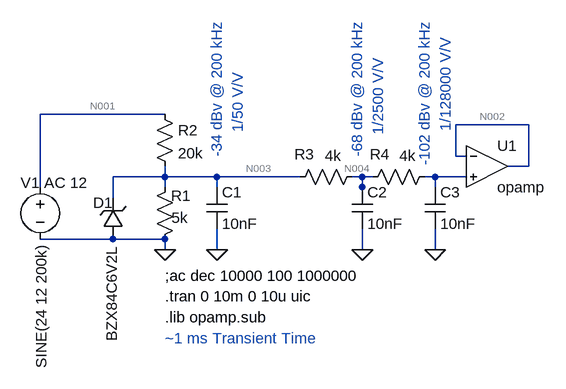
[diagram p0: schematic Draft1.asc]
Draft1.asc, the LTspice schematic file:
Version 4
SHEET 1 1332 680
WIRE 288 48 96 48
WIRE 848 64 736 64
WIRE 736 112 736 64
WIRE 752 112 736 112
WIRE 848 128 848 64
WIRE 848 128 816 128
WIRE 288 144 288 128
WIRE 288 144 208 144
WIRE 368 144 288 144
WIRE 496 144 368 144
WIRE 592 144 576 144
WIRE 608 144 592 144
WIRE 704 144 688 144
WIRE 752 144 704 144
WIRE 96 160 96 48
WIRE 288 160 288 144
WIRE 368 160 368 144
WIRE 592 160 592 144
WIRE 704 160 704 144
WIRE 208 176 208 144
WIRE 592 176 592 160
WIRE 208 240 96 240
WIRE 288 240 208 240
WIRE 288 256 288 240
WIRE 368 256 368 224
WIRE 592 256 592 224
WIRE 704 256 704 224
FLAG 288 256 0
FLAG 592 256 0
FLAG 704 256 0
FLAG 368 256 0
SYMBOL res 304 144 M0
WINDOW 0 -24 29 Left 2
WINDOW 3 -20 63 Left 2
SYMATTR InstName R1
SYMATTR Value 5k
SYMBOL zener 224 240 R180
WINDOW 0 16 56 Left 2
WINDOW 3 18 -157 VRight 2
SYMATTR InstName D1
SYMATTR Value BZX84C6V2L
SYMATTR Description Diode
SYMATTR Type diode
SYMBOL res 272 32 R0
SYMATTR InstName R2
SYMATTR Value 20k
SYMBOL voltage 96 144 R0
WINDOW 3 2 103 VRight 2
WINDOW 123 6 9 Left 2
WINDOW 39 0 0 Left 0
WINDOW 0 -30 9 Left 2
SYMATTR Value SINE(24 12 200k)
SYMATTR Value2 AC 12
SYMATTR InstName V1
SYMBOL cap 352 160 R0
SYMATTR InstName C1
SYMATTR Value 10nF
SYMBOL Opamps\\opamp 784 64 R0
SYMATTR InstName U1
SYMBOL res 592 128 R90
WINDOW 0 -3 89 VBottom 2
WINDOW 3 -32 45 VTop 2
SYMATTR InstName R3
SYMATTR Value 4k
SYMBOL cap 576 160 R0
SYMATTR InstName C2
SYMATTR Value 10nF
SYMBOL res 704 128 R90
WINDOW 0 -3 85 VBottom 2
WINDOW 3 -32 42 VTop 2
SYMATTR InstName R4
SYMATTR Value 4k
SYMBOL cap 688 160 R0
SYMATTR InstName C3
SYMATTR Value 10nF
TEXT 288 328 Left 2 !.tran 0 10m 0 10u uic
TEXT 288 360 Left 2 !.lib opamp.sub
TEXT 688 -96 VRight 2 ;-102 dBv @ 200 kHz
TEXT 584 -96 VRight 2 ;-68 dBv @ 200 kHz
TEXT 368 -96 VRight 2 ;-34 dBv @ 200 kHz
TEXT 288 296 Left 2 !;ac dec 10000 100 1000000
TEXT 400 -16 VRight 2 ;1/50 V/V
TEXT 616 -40 VRight 2 ;1/2500 V/V
TEXT 720 -72 VRight 2 ;1/128000 V/V
TEXT 288 392 Left 2 ;~1 ms Transient Time

The netlist it stands for:
* Draft1.asc
R1 N003 0 5k
D1 0 N003 BZX84C6V2L
R2 N001 N003 20k
V1 N001 0 SINE(24 12 200k) AC 12
C1 N003 0 10nF
XU1 N002 N005 N002 opamp Aol=100K GBW=10Meg  ; pins invin noninvin out
R3 N004 N003 4k
C2 N004 0 10nF
R4 N005 N004 4k
C3 N005 0 10nF
.model D D
.lib standard.dio
.tran 0 10m 0 10u uic
.lib opamp.sub
* -102 dBv @ 200 kHz
* -68 dBv @ 200 kHz
* -34 dBv @ 200 kHz
;ac dec 10000 100 1000000
* 1/50 V/V
* 1/2500 V/V
* 1/128000 V/V
* ~1 ms Transient Time
.backanno
.end

* Results of the author's LTspice run, read from the files saved beside the schematic
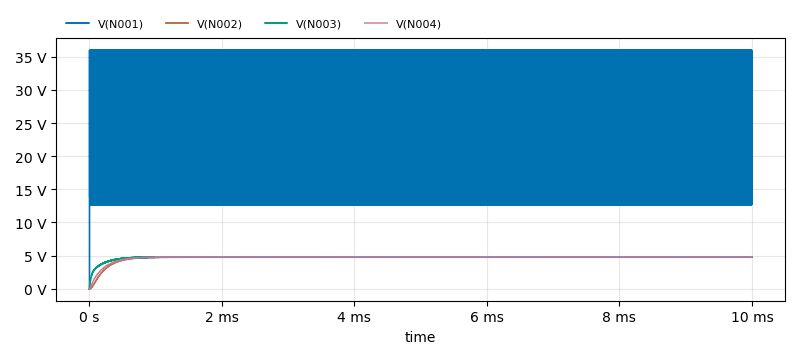
[diagram p1: Transient Analysis of Draft1.asc, plotted from the saved traces]
* Transient Analysis, 1 run:
*   V(N001): min 0 V, max 36 V, average 24 V, rms 25.5 V, last 24 V
*   V(N002): min 0 V, max 4.8 V, average 4.685 V, rms 4.717 V, last 4.8 V
*   V(N003): min 0 V, max 4.843 V, average 4.742 V, rms 4.752 V, last 4.753 V
*   V(N004): min 0 V, max 4.801 V, average 4.704 V, rms 4.728 V, last 4.8 V